# Altium schematic sheet main.SchDoc
size A
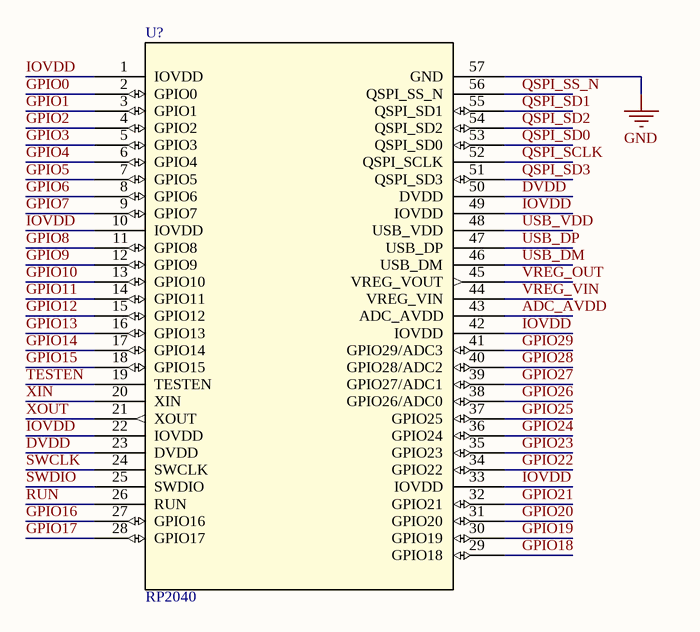
[diagram p0: main.SchDoc]

## Parts
U?  RP2040  [RP2040]

## Nets
GND: U?.57(GND)
ADC_AVDD: U?.43(ADC_AVDD)
DVDD: U?.23(DVDD) U?.50(DVDD)
GPIO0: U?.2(GPIO0)
GPIO1: U?.3(GPIO1)
GPIO2: U?.4(GPIO2)
GPIO3: U?.5(GPIO3)
GPIO4: U?.6(GPIO4)
GPIO5: U?.7(GPIO5)
GPIO6: U?.8(GPIO6)
GPIO7: U?.9(GPIO7)
GPIO8: U?.11(GPIO8)
GPIO9: U?.12(GPIO9)
GPIO10: U?.13(GPIO10)
GPIO11: U?.14(GPIO11)
GPIO12: U?.15(GPIO12)
GPIO13: U?.16(GPIO13)
GPIO14: U?.17(GPIO14)
GPIO15: U?.18(GPIO15)
GPIO16: U?.27(GPIO16)
GPIO17: U?.28(GPIO17)
GPIO18: U?.29(GPIO18)
GPIO19: U?.30(GPIO19)
GPIO20: U?.31(GPIO20)
GPIO21: U?.32(GPIO21)
GPIO22: U?.34(GPIO22)
GPIO23: U?.35(GPIO23)
GPIO24: U?.36(GPIO24)
GPIO25: U?.37(GPIO25)
GPIO26: U?.38(GPIO26/ADC0)
GPIO27: U?.39(GPIO27/ADC1)
GPIO28: U?.40(GPIO28/ADC2)
GPIO29: U?.41(GPIO29/ADC3)
IOVDD: U?.1(IOVDD) U?.10(IOVDD) U?.22(IOVDD) U?.33(IOVDD) U?.42(IOVDD) U?.49(IOVDD)
QSPI_SCLK: U?.52(QSPI_SCLK)
QSPI_SD0: U?.53(QSPI_SD0)
QSPI_SD1: U?.55(QSPI_SD1)
QSPI_SD2: U?.54(QSPI_SD2)
QSPI_SD3: U?.51(QSPI_SD3)
QSPI_SS_N: U?.56(QSPI_SS_N)
RUN: U?.26(RUN)
SWCLK: U?.24(SWCLK)
SWDIO: U?.25(SWDIO)
TESTEN: U?.19(TESTEN)
USB_DM: U?.46(USB_DM)
USB_DP: U?.47(USB_DP)
USB_VDD: U?.48(USB_VDD)
VREG_OUT: U?.45(VREG_VOUT)
VREG_VIN: U?.44(VREG_VIN)
XIN: U?.20(XIN)
XOUT: U?.21(XOUT)

## Library data of the parts
U? = RP2040: No Description Available; Manufacturer: Raspberry Pi; Manufacturer Part Number: SC0914(13); Supplier 1: Digi-Key; RoHS: No; Category: Uncategorized; Stock 1: 117672; Pricing 1: 1=1.00000 (USD); Supplier Part Number 1: 2648-SC0914(13)CT-ND